# Altium schematic sheet Low Distortion Oscillator.LDO.SchDoc
size A4
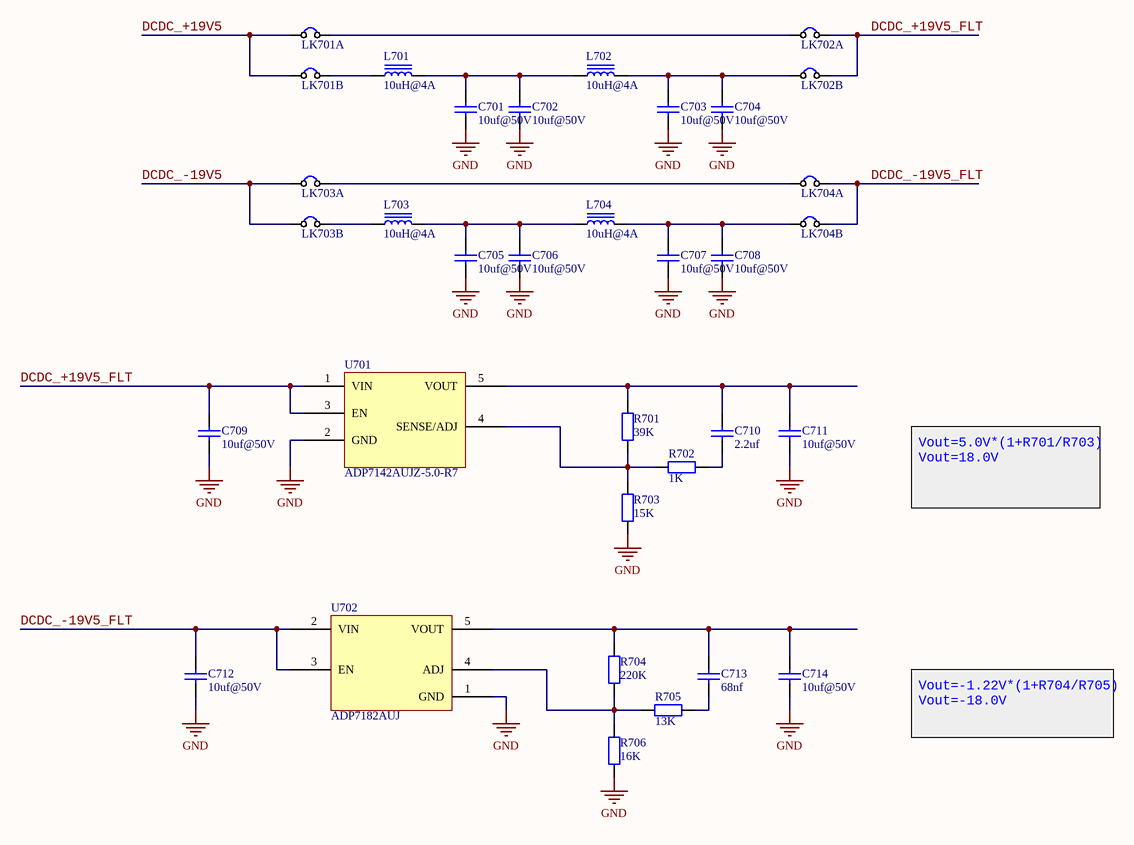
[diagram p0: Low Distortion Oscillator.LDO.SchDoc]

## Parts
C701  value 10uf@50V  [C1206]  (hidden comment: Cap)
C702  value 10uf@50V  [C1206]  (hidden comment: Cap)
C703  value 10uf@50V  [C1206]  (hidden comment: Cap)
C704  value 10uf@50V  [C1206]  (hidden comment: Cap)
C705  value 10uf@50V  [C1206]  (hidden comment: Cap)
C706  value 10uf@50V  [C1206]  (hidden comment: Cap)
C707  value 10uf@50V  [C1206]  (hidden comment: Cap)
C708  value 10uf@50V  [C1206]  (hidden comment: Cap)
C709  value 10uf@50V  [C1206]  (hidden comment: Cap)
C710  value 2.2uf  [C0603]  (hidden comment: Cap)
C711  value 10uf@50V  [C1206]  (hidden comment: Cap)
C712  value 10uf@50V  [C0805]  (hidden comment: Cap)
C713  value 68nf  [C0603]  (hidden comment: Cap)
C714  value 10uf@50V  [C1206]  (hidden comment: Cap)
L701  value 10uH@4A  [L06063]  (hidden comment: Inductor Iron)
L702  value 10uH@4A  [L06063]  (hidden comment: Inductor Iron)
L703  value 10uH@4A  [L06063]  (hidden comment: Inductor Iron)
L704  value 10uH@4A  [L06063]  (hidden comment: Inductor Iron)
LK701  Link-2X2  [Link-2X2-THD]  (value not drawn)  (parts A,B of 2)
LK702  Link-2X2  [Link-2X2-THD]  (value not drawn)  (parts A,B of 2)
LK703  Link-2X2  [Link-2X2-THD]  (value not drawn)  (parts A,B of 2)
LK704  Link-2X2  [Link-2X2-THD]  (value not drawn)  (parts A,B of 2)
R701  value 39K  [R0603]  (hidden comment: Res)
R702  value 1K  [R0603]  (hidden comment: Res)
R703  value 15K  [R0603]  (hidden comment: Res)
R704  value 220K  [R0603]  (hidden comment: Res)
R705  value 13K  [R0603]  (hidden comment: Res)
R706  value 16K  [R0603]  (hidden comment: Res)
U701  ADP7142AUJZ-5.0-R7  [ADP7142-TSOT5]
U702  ADP7182AUJ  [ADP7182-TSOT5]

## Nets
GND: C701.1 C702.1 C703.1 C704.1 C705.1 C706.1 C707.1 C708.1 C709.1 C711.1 C712.1 C714.1 R703.1 R706.1 U701.2(GND) U702.1(GND)
DCDC_+19V5: LK701.1 LK701.3
DCDC_+19V5_FLT: C709.2 LK702.2 LK702.4 U701.1(VIN) U701.3(EN)
DCDC_-19V5: LK703.1 LK703.3
DCDC_-19V5_FLT: C712.2 LK704.2 LK704.4 U702.2(VIN) U702.3(EN)
NetC701_2: C701.2 C702.2 L701.2 L702.1
NetC703_2: C703.2 C704.2 L702.2 LK702.3
NetC705_2: C705.2 C706.2 L703.2 L704.1
NetC707_2: C707.2 C708.2 L704.2 LK704.3
NetC710_1: C710.1 R702.1
NetC710_2: C710.2 C711.2 R701.2 U701.5(VOUT)
NetC713_1: C713.1 R705.1
NetC713_2: C713.2 C714.2 R704.2 U702.5(VOUT)
NetL701_1: L701.1 LK701.4
NetL703_1: L703.1 LK703.4
NetLK701_2: LK701.2 LK702.1
NetLK703_2: LK703.2 LK704.1
NetR701_1: R701.1 R702.2 R703.2 U701.4(SENSE/ADJ)
NetR704_1: R704.1 R705.2 R706.2 U702.4(ADJ)

## Notes on the sheet
- Vout=5.0V*(1+R701/R703)
  Vout=18.0V
- Vout=-1.22V*(1+R704/R705)
  Vout=-18.0V

## Library data of the parts
L701-L704 = Inductor Iron: Magnetic-Core Inductor
R701-R706 = Res: 电阻
U701 = ADP7142AUJ: 40 V, 200 mA, Low Noise, CMOS LDO Linear Regulator
U702 = ADP7182AUJ: –28 V, −200 mA, Low Noise, Linear Regulator